# EAGLE design replay_adapter (EAGLE 6.4)
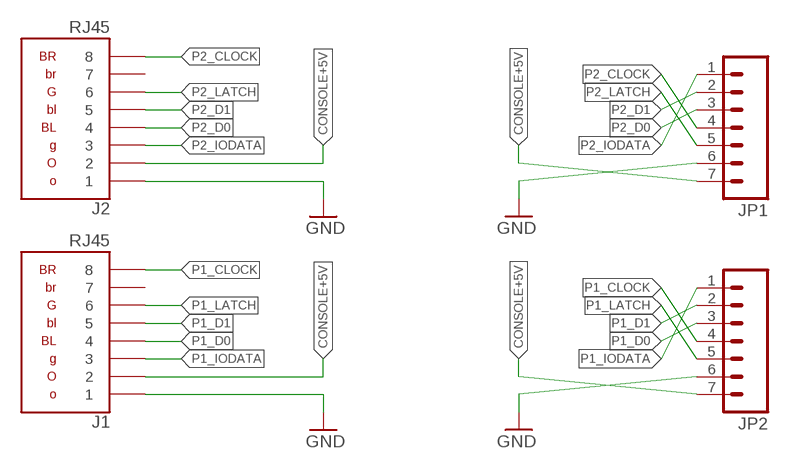
[diagram p0: schematic, sheet 1]

## Parts
J1  RJ45  [RJ45]
J2  RJ45  [RJ45]
JP1  M07  [1X07]
JP2  M07  [1X07]

## Nets
CONSOLE+5V: J1.2 J2.2 JP1.7 JP2.7
GND: J1.1 J2.1 JP1.6 JP2.6
P1_CLOCK: J1.8 JP2.4
P1_D0: J1.4 JP2.3
P1_D1: J1.5 JP2.2
P1_IODATA: J1.3 JP2.1
P1_LATCH: J1.6 JP2.5
P2_CLOCK: J2.8 JP1.4
P2_D0: J2.4 JP1.3
P2_D1: J2.5 JP1.2
P2_IODATA: J2.3 JP1.1
P2_LATCH: J2.6 JP1.5
Unconnected: J1.7 J2.7

## Library data of the parts
J1 J2 = TASLink:RJ45
JP1 JP2 = SparkFun-Connectors:M07: Header 7 Standard 7-pin 0.1" header. Use with straight break away headers (SKU : PRT-00116), right angle break away headers (PRT-00553), swiss pins (PRT-00743), machine pins (PRT-00117), and female headers (PRT-00115). NOTES ON THE VARIANTS LOCK and LOCK_LONGPADS... This footprint was designed to help hold the alignment of a through-hole component (i.e. 7-pin header) while soldering it into place. You may notice that each hole has been shifted either up or down by 0.005 of an inch from it's more standard position (which is usually a perfectly straight line). This slight alteration caused the pins (the squares in the middle) to touch the edges of the holes. Because they are alternating, it causes a "brace" to hold the header in place. 0.005 has proven to be the perfect amount of "off-center" position when using our standard breakaway headers. Although looks a little odd when you look at the bare footprint, once you have a header in there, the alteration is very hard to notice. Also, if you push a header all the way into place, it is covered up entirely on the bottom side. This idea of altering the position of holes to aid alignment will be further integrated into the Sparkfun Library for other footprints. It can help hold any component with 3 or more connection pins.

## Board
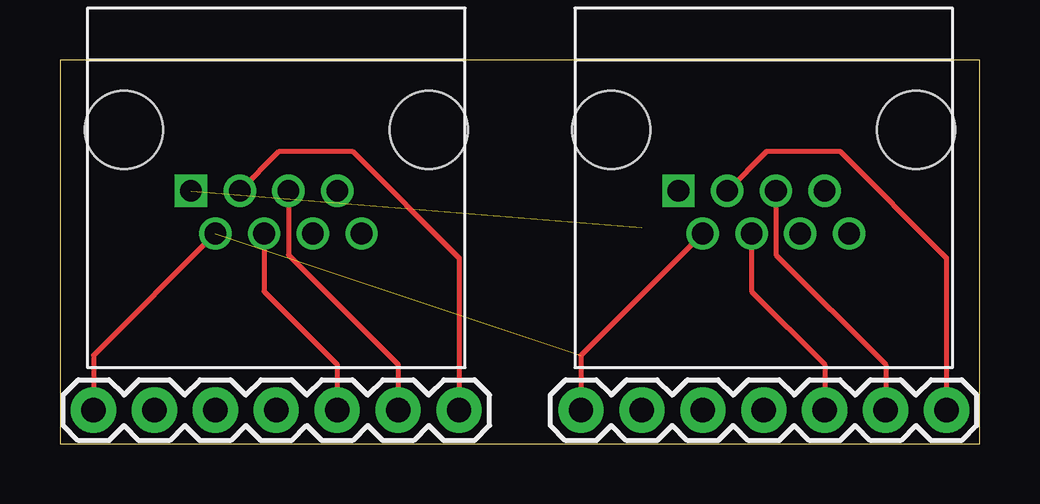
[diagram p1: board, top side]
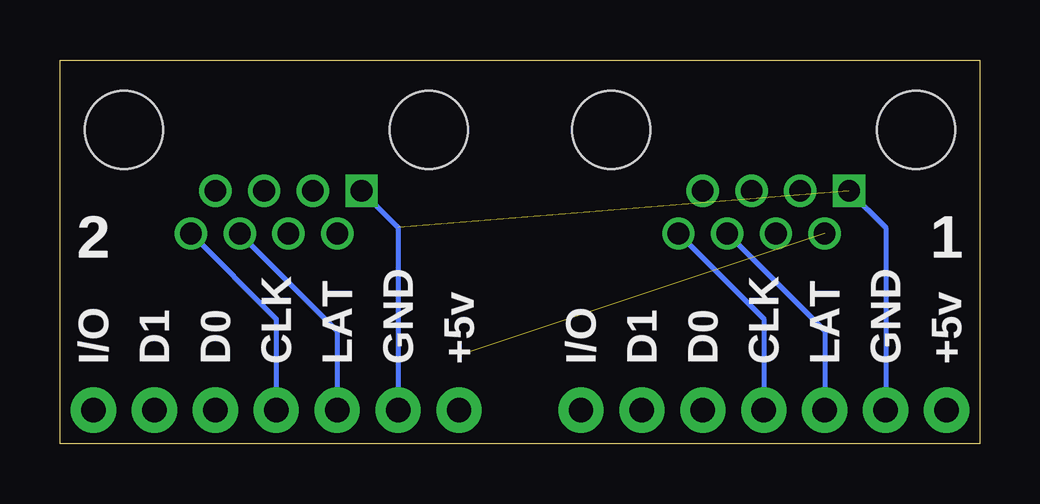
[diagram p2: board, bottom side, seen from below]

Size 38.35 x 16 mm. Coordinates in mm from the lower left corner, seen from the top.
Outline: 0,0 38.35,0 38.35,16 0,16 0,0
Copper layers (1*16): Top 0.0356mm / dielectric 1.5011mm / Bottom 0.0356mm
Design rules "LaenPCBOrder": minimum track width 6mil, minimum drill 13mil, track to track 6mil, track to pad 6mil, pad to pad 6mil, via to via 6mil, smd to smd 6mil, copper to edge 15mil, drill to drill 6mil, minimum pad ring 7mil, minimum via ring 7mil, stop-mask expansion 3mil, vias tented up to drill 0mil, thermal gap 10mil

### Footprints (pad centres in the part's own frame; a part is rotated, then mirrored left to right if it is on the bottom)
RJ45 = drill 0.9 square: 1 3.556,-0.889 | drill 0.9: 2 2.54,0.889; 3 1.524,-0.889; 4 0.508,0.889; 5 -0.508,-0.889; 6 -1.524,0.889; 7 -2.54,-0.889; 8 -3.556,0.889 | hole 3.251: -6.35,-3.429; 6.35,-3.429
1X07 = drill 1.016 pad 1.88: 1 0,0; 2 2.54,0; 3 5.08,0; 4 7.62,0; 5 10.16,0; 6 12.7,0; 7 15.24,0

### Placement (x,y rotation side)
J1  9.02,9.65 180 top
J2  29.34,9.65 180 top
JP1  36.96,1.4 180 top
JP2  16.64,1.4 180 top

### Tracks (layer width: path | path; a pad name or v marks a point on that pad's centre or on a via)
CONSOLE+5V  (1 unrouted)
  Top 0.203: J2.2 21.72,3.68 JP1.7 | J1.2 1.4,3.68 JP2.7
GND  (1 unrouted)
  Bottom 0.203: J2.1 24.26,9.02 JP1.6 | J1.1 3.94,9.02 JP2.6
P1_CLOCK
  Bottom 0.203: J1.8 9.02,5.21 JP2.4
P1_D0
  Top 0.203: J1.4 8.51,6.35 11.56,3.3 JP2.3
P1_D1
  Top 0.203: J1.5 9.53,7.87 14.1,3.3 JP2.2
P1_IODATA
  Top 0.203: J1.3 9.14,12.19 12.19,12.19 16.64,7.75 JP2.1
P1_LATCH
  Bottom 0.203: J1.6 6.48,4.7 JP2.5
P2_CLOCK
  Bottom 0.203: J2.8 29.34,5.21 JP1.4
P2_D0
  Top 0.203: J2.4 28.83,6.35 31.88,3.3 JP1.3
P2_D1
  Top 0.203: J2.5 29.84,7.87 34.42,3.3 JP1.2
P2_IODATA
  Top 0.203: J2.3 29.46,12.19 32.51,12.19 36.96,7.75 JP1.1
P2_LATCH
  Bottom 0.203: J2.6 26.8,4.7 JP1.5

### Text on the board
bPlace: 1 | 2 | +5v | GND | LAT | CLK | D0 | D1 | I/O | +5v | GND | LAT | CLK | D0 | D1 | I/O